# EAGLE design schematic (EAGLE 6.5.0)
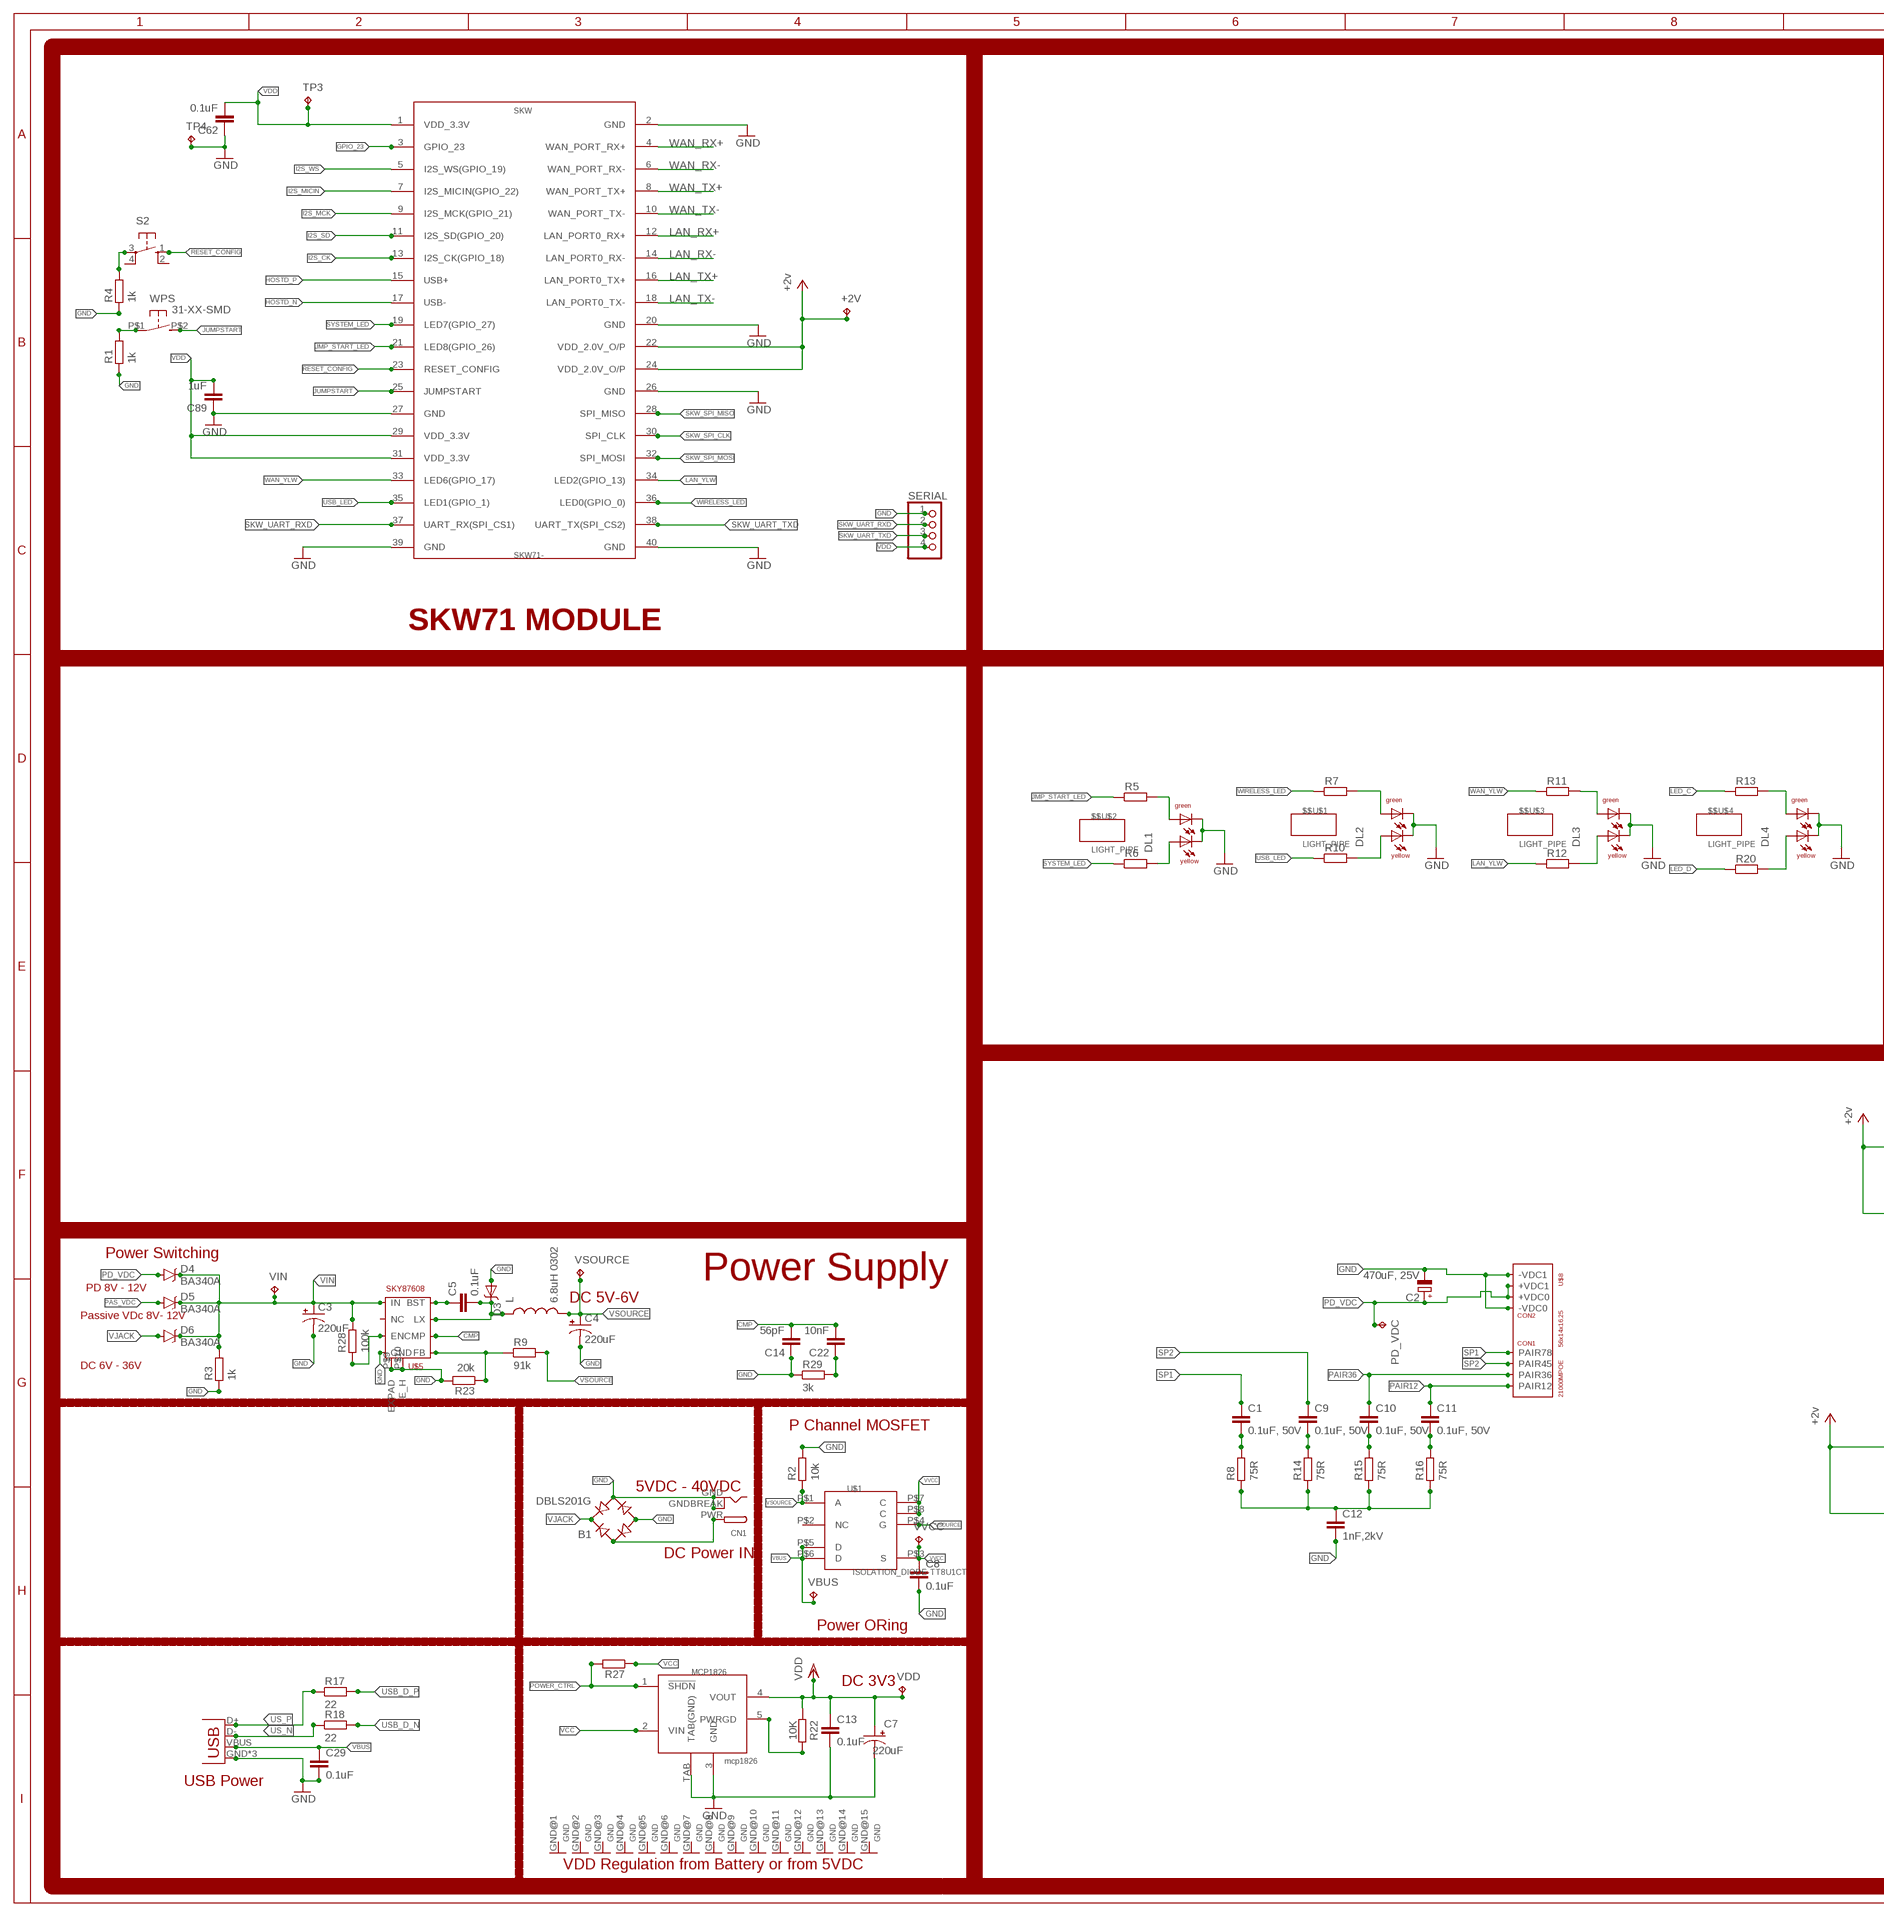
[diagram p0: schematic, sheet 1, part 1 of 2]
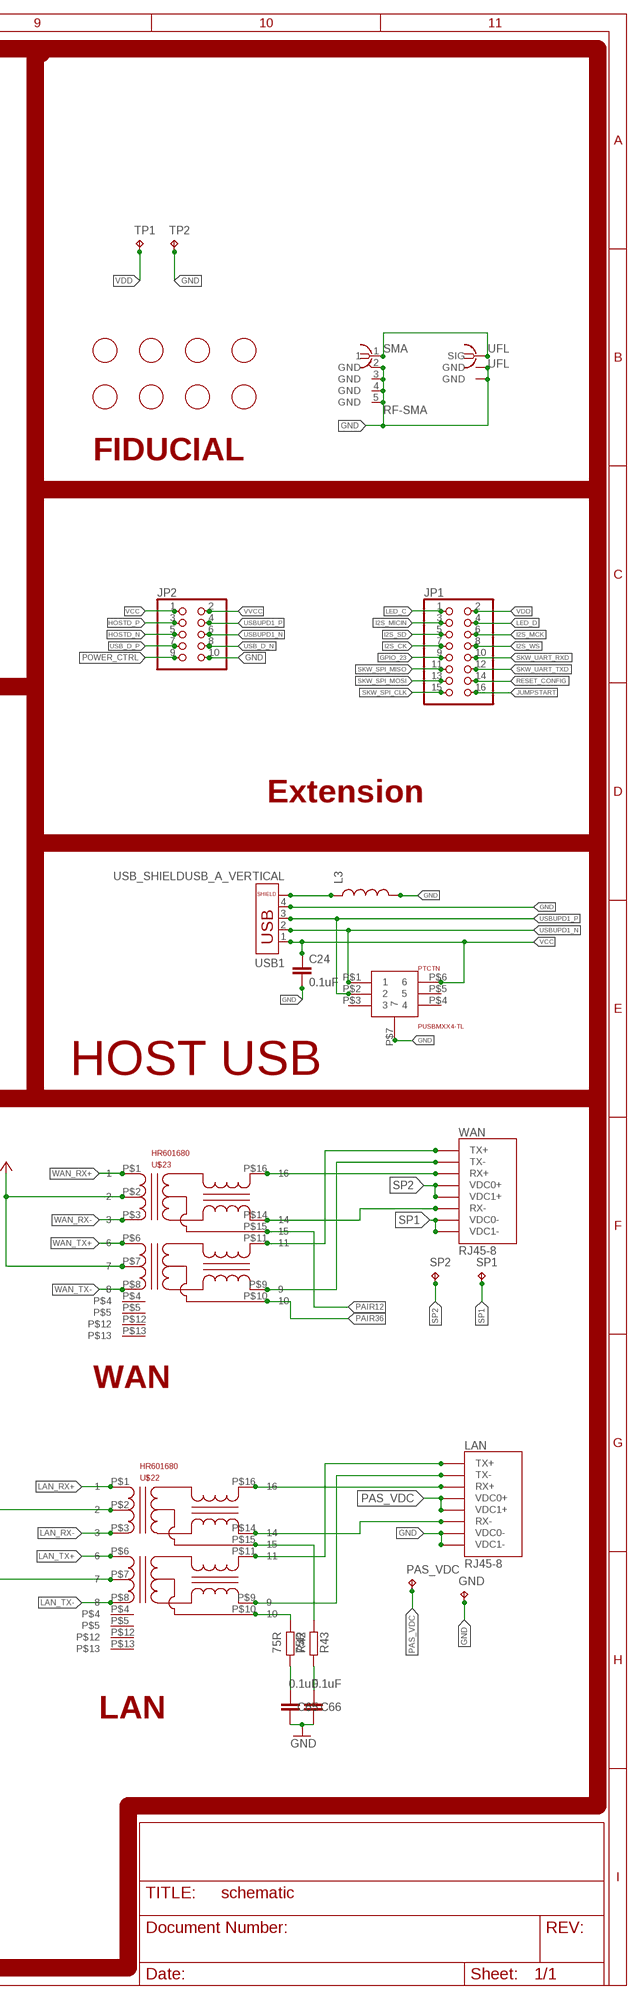
[diagram p1: schematic, sheet 1, part 2 of 2]

## Parts
$$U$1  LIGHT_PIPE  [LIGHT-PIPE]
$$U$2  LIGHT_PIPE  [LIGHT-PIPE]
$$U$3  LIGHT_PIPE  [LIGHT-PIPE]
$$U$4  LIGHT_PIPE  [LIGHT-PIPE]
+2V  TPB2,54  [B2,54]
B1  DBLS201G  [DBS]
C1  0.1uF, 50V  CAPACITOR  [C0603]
C2  470uF, 25V  CPOL-EUE3.5-10  [E3,5-10]
C3  220uF  CPOL-USE3.5-10  [E3,5-10]
C4  220uF  CPOL-USE5-10.5  [E5-10,5]
C5  0.1uF  CAPACITOR  [C0603]
C7  220uF  CPOL-USE5-10.5  [E5-10,5]
C8  0.1uF  CAPACITOR  [C0603]
C9  0.1uF, 50V  CAPACITOR  [C0603]
C10  0.1uF, 50V  CAPACITOR  [C0603]
C11  0.1uF, 50V  CAPACITOR  [C0603]
C12  1nF,2kV  CAPACITOR  [C0603]
C13  0.1uF  CAPACITOR  [C0603]
C14  56pF  CAPACITOR  [C0603]
C22  10nF  CAPACITOR  [C0603]
C24  0.1uF  CAPACITOR  [C0603]
C29  0.1uF  CAPACITOR  [C0603]
C62  0.1uF  CAPACITOR  [C0603]
C65  0.1uF  CAPACITOR  [C0603]
C66  0.1uF  CAPACITOR  [C0603]
C89  1uF  CAPACITOR  [C0603]
CN1  DCBARRELPTH  [DCJACK_2MM_PTH]
D3  DIODE-SCHOTTKY_  [SMA-DIODE]
D4  BA340A  B340A  [SMA-DIODE]
D5  BA340A  B340A  [SMA-DIODE]
D6  BA340A  B340A  [SMA-DIODE]
DL1  DUOLED-1X2  [DUOLED-C-0603]
DL2  DUOLED-1X2  [DUOLED-C-0603]
DL3  DUOLED-1X2  [DUOLED-C-0603]
DL4  DUOLED-1X2  [DUOLED-C-0603]
GND  TPB2,54  [B2,54]
JP1  PINHD-2X8  [2X08]
JP2  PINHD-2X5  [2X05]
JP4  USB-MICROB  [USB-MICROB]
L  6.8uH 0302  INDUCTORBOURNS_SRN6045  [SRN6045]
L3  INDUCTOR0603  [0603]
LAN  RJ45-8  [RJHSE-5080-ND]
MCP1826  mcp1826  MCP1825T  [SOT223-5]
PAS_VDC  TPB2,54  [B2,54]
PD_VDC  TPB2,54  [B2,54]
PTCTN  PUSBMXX4-TL  [PUSBMXX4-TL]
R1  1k  RESISTOR  [R0603]
R2  10k  RESISTOR  [R0603]
R3  1k  RESISTOR  [R0603]
R4  1k  RESISTOR  [R0603]
R5  RESISTOR  [R0603]
R6  RESISTOR  [R0603]
R7  RESISTOR  [R0603]
R8  75R  RESISTOR  [R0603]
R9  91k  RESISTOR  [R0603]
R10  RESISTOR  [R0603]
R11  RESISTOR  [R0603]
R12  RESISTOR  [R0603]
R13  RESISTOR  [R0603]
R14  75R  RESISTOR  [R0603]
R15  75R  RESISTOR  [R0603]
R16  75R  RESISTOR  [R0603]
R17  22  RESISTOR  [R0603]
R18  22  RESISTOR  [R0603]
R20  RESISTOR  [R0603]
R22  10K  RESISTOR  [R0603]
R23  20k  RESISTOR  [R0603]
R27  RESISTOR  [R0603]
R28  100k  RESISTOR  [R0603]
R29  3k  RESISTOR  [R0603]
R42  75R  RESISTOR  [R0603]
R43  75R  RESISTOR  [R0603]
S2  10-XX  [B3F-10XX]
SERIAL  PINHD-1X4  [1X04]
SKW  SKW71-  [SKW71-SMT]
SMA  RF-SMA  [BU-SMA-H]
SP1  TPB2,54  [B2,54]
SP2  TPB2,54  [B2,54]
TP1  TPB2,54  [B2,54]
TP2  TPB2,54  [B2,54]
TP3  TPB2,54  [B2,54]
TP4  TPB2,54  [B2,54]
U$1  ISOLATION_DIODE-TT8U1CT  [8-TSST]
U$5  SKY87608  [8PIN-SOP-8L-EP]
U$8  21000MPOE  [21000MPOE]
U$9  FIDUCIAL  [FIDUCIAL_1MM]
U$11  FIDUCIAL  [FIDUCIAL_1MM]
U$12  FIDUCIAL  [FIDUCIAL_1MM]
U$13  FIDUCIAL  [FIDUCIAL_1MM]
U$14  FIDUCIAL  [FIDUCIAL_1MM]
U$15  FIDUCIAL  [FIDUCIAL_1MM]
U$16  FIDUCIAL  [FIDUCIAL_1MM]
U$17  FIDUCIAL  [FIDUCIAL_1MM]
U$22  HR601680  [SOIC-16]
U$23  HR601680  [SOIC-16]
UFL  UFL  [UFL]
USB1  USB_SHIELDUSB_A_VERTICAL  [USB_A_VERTICAL_PTH]
VBUS  TPB2,54  [B2,54]
VDD  TPB2,54  [B2,54]
VIN  TPB2,54  [B2,54]
VSOURCE  TPB2,54  [B2,54]
VVCC  TPB2,54  [B2,54]
WAN  RJ45-8  [RJHSE-5080-ND]
WPS  31-XX-SMD  [BF3-31XX_SMD_PAD]

## Nets
+2V [power]: +2V.TP SKW.22(VDD_2.0V_O/P) SKW.24(VDD_2.0V_O/P) U$22.P$2 U$22.P$7 U$23.P$2 U$23.P$7 ; supply symbol labelled +2v
CMP: C14.2 C22.2 U$5.P$6(CMP)
GND: B1.- B1.AC2 C2.- C3.- C4.- C7.- C8.2 C12.2 C13.2 C14.1 C24.2 C29.2 C62.1 C65.1 C66.1 C89.1 CN1.GND CN1.GNDBREAK D3.A DL1.C1 DL1.C2 DL2.C1 DL2.C2 DL3.C1 DL3.C2 DL4.C1 DL4.C2 GND.TP JP2.10 JP4.GND JP4.MT1(GND) JP4.MT2(GND) L3.2 LAN.P$7(VDC0-) LAN.P$8(VDC1-) MCP1826.3(GND) MCP1826.TAB(TAB(GND)) PTCTN.P$7 R1.1 R2.2 R3.1 R4.1 R23.2 R29.1 SERIAL.1 SKW.2(GND) SKW.20(GND) SKW.26(GND) SKW.27(GND) SKW.39(GND) SKW.40(GND) SMA.2(GND) SMA.3(GND) SMA.4(GND) SMA.5(GND) TP2.TP TP4.TP U$5.P$4(GND) U$5.P$9(EXPAD) U$5.P$10(E_H) U$8.P$5(-VDC0) U$8.P$8(-VDC1) UFL.GND@1(GND) UFL.GND@2(GND) USB1.4
GPIO_23: JP1.9 SKW.3(GPIO_23)
HOSTD_N: JP2.5 SKW.17(USB-)
HOSTD_P: JP2.3 SKW.15(USB+)
I2S_CK: JP1.7 SKW.13(I2S_CK(GPIO_18))
I2S_MCK: JP1.6 SKW.9(I2S_MCK(GPIO_21))
I2S_MICIN: JP1.3 SKW.7(I2S_MICIN(GPIO_22))
I2S_SD: JP1.5 SKW.11(I2S_SD(GPIO_20))
I2S_WS: JP1.8 SKW.5(I2S_WS(GPIO_19))
JMP_START_LED: R5.1 SKW.21(LED8(GPIO_26))
JUMPSTART: JP1.16 SKW.25(JUMPSTART) WPS.P$2(S)
LAN_RX+: SKW.12(LAN_PORT0_RX+) U$22.P$1
LAN_RX-: SKW.14(LAN_PORT0_RX-) U$22.P$3
LAN_TX+: SKW.16(LAN_PORT0_TX+) U$22.P$6
LAN_TX-: SKW.18(LAN_PORT0_TX-) U$22.P$8
LAN_YLW: R12.1 SKW.34(LED2(GPIO_13))
LED_C: JP1.1 R13.1
LED_D: JP1.4 R20.1
N$1: DL2.A1 R7.2
N$2: C5.2 D3.C L.1 U$5.P$2(LX)
N$3: DL1.A1 R5.2
N$4: DL2.A2 R10.2
N$5: R1.2 WPS.P$1(P)
N$7: C1.2 R8.2
N$10: R4.2 S2.3(P)
N$13: C9.2 R14.2
N$16: SMA.1 UFL.SIG
N$17: DL3.A2 R12.2
N$18: C10.2 R15.2
N$19: DL4.A1 R13.2
N$20: MCP1826.5(PWRGD) R22.2
N$21: C12.1 R8.1 R14.1 R15.1 R16.1
N$22: R28.1 U$5.P$7(EN)
N$24: C11.2 R16.2
N$26: C5.1 U$5.P$8(BST)
N$27: R9.1 R23.1 U$5.P$5(FB)
N$29: DL4.A2 R20.2
N$35: DL3.A1 R11.2
N$37: C22.1 R29.2
N$40: DL1.A2 R6.2
N$41: L3.1 USB1.P$3
N$44: B1.AC1 CN1.PWR
N$48: U$23.P$16 WAN.P$3(RX+)
N$49: U$23.P$14 WAN.P$6(RX-)
N$51: U$23.P$11 WAN.P$1(TX+)
N$52: U$23.P$9 WAN.P$2(TX-)
N$54: R42.1 U$22.P$10
N$55: LAN.P$2(TX-) U$22.P$9
N$56: LAN.P$1(TX+) U$22.P$11
N$57: R43.1 U$22.P$15
N$58: LAN.P$6(RX-) U$22.P$14
N$59: LAN.P$3(RX+) U$22.P$16
N$69: C65.2 R42.2
N$70: C66.2 R43.2
PAIR12: C11.1 U$8.P$1(PAIR12) U$23.P$15
PAIR36: C10.1 U$8.P$2(PAIR36) U$23.P$10
PAS_VDC: D5.A LAN.P$4(VDC0+) LAN.P$5(VDC1+) PAS_VDC.TP
PD_VDC: C2.+ D4.A PD_VDC.TP U$8.P$6(+VDC0) U$8.P$7(+VDC1)
POWER_CTRL: JP2.9 MCP1826.1(!SHDN) R27.2
RESET_CONFIG: JP1.14 S2.1(S) SKW.23(RESET_CONFIG)
SKW_SPI_CLK: JP1.15 SKW.30(SPI_CLK)
SKW_SPI_MISO: JP1.11 SKW.28(SPI_MISO)
SKW_SPI_MOSI: JP1.13 SKW.32(SPI_MOSI)
SKW_UART_RXD: JP1.10 SERIAL.2 SKW.37(UART_RX(SPI_CS1))
SKW_UART_TXD: JP1.12 SERIAL.3 SKW.38(UART_TX(SPI_CS2))
SP1: C1.1 SP1.TP U$8.P$4(PAIR78) WAN.P$7(VDC0-) WAN.P$8(VDC1-)
SP2: C9.1 SP2.TP U$8.P$3(PAIR45) WAN.P$4(VDC0+) WAN.P$5(VDC1+)
SYSTEM_LED: R6.1 SKW.19(LED7(GPIO_27))
US_N: JP4.D- R18.1
US_P: JP4.D+ R17.1
USB_D_N: JP2.8 R18.2
USB_D_P: JP2.7 R17.2
USB_LED: R10.1 SKW.35(LED1(GPIO_1))
USBUPD1_N: JP2.6 PTCTN.P$1 USB1.2
USBUPD1_P: JP2.4 PTCTN.P$2 USB1.3
VBUS: C29.1 JP4.VBUS U$1.P$5(D) U$1.P$6(D) VBUS.TP
VCC: C24.1 JP2.1 MCP1826.2(VIN) PTCTN.P$6 R27.1 USB1.1
VDD: C7.+ C13.1 C62.2 C89.2 JP1.2 MCP1826.4(VOUT) R22.1 SERIAL.4 SKW.1(VDD_3.3V) SKW.29(VDD_3.3V) SKW.31(VDD_3.3V) TP1.TP TP3.TP VDD.TP
VIN: C3.+ D4.C D5.C D6.C R3.2 R28.2 U$5.P$1(IN) VIN.TP
VJACK: B1.+ D6.A
VSOURCE: C4.+ L.2 R2.1 R9.2 U$1.P$1(A) U$1.P$4(G) VSOURCE.TP
VVCC: C8.1 JP2.2 U$1.P$3(S) U$1.P$7(C) U$1.P$8(C) VVCC.TP
WAN_RX+: SKW.4(WAN_PORT_RX+) U$23.P$1
WAN_RX-: SKW.6(WAN_PORT_RX-) U$23.P$3
WAN_TX+: SKW.8(WAN_PORT_TX+) U$23.P$6
WAN_TX-: SKW.10(WAN_PORT_TX-) U$23.P$8
WAN_YLW: R11.1 SKW.33(LED6(GPIO_17))
WIRELESS_LED: R7.1 SKW.36(LED0(GPIO_0))
Unconnected: PTCTN.P$3 PTCTN.P$4 PTCTN.P$5 S2.2(S1) S2.4(P1) U$1.P$2(NC) U$5.P$3(NC) U$22.P$4 U$22.P$5 U$22.P$12 U$22.P$13 U$23.P$4 U$23.P$5 U$23.P$12 U$23.P$13

## Notes on the sheet
- FIDUCIAL
- SKW71 MODULE
- Extension
- HOST USB
- Power Switching
- Power Supply
- PD 8V - 12V
- DC 5V-6V
- Passive VDc 8V- 12V
- WAN
- DC 6V - 36V
- P Channel MOSFET
- 5VDC - 40VDC
- DC Power IN
- Power ORing
- LAN
- DC 3V3
- USB Power
- VDD Regulation from Battery or from 5VDC

## Power pins joined to a net without a drawn wire
GND: MCP1826.GND@1(GND) MCP1826.GND@2(GND) MCP1826.GND@3(GND) MCP1826.GND@4(GND) MCP1826.GND@5(GND) MCP1826.GND@6(GND) MCP1826.GND@7(GND) MCP1826.GND@8(GND) MCP1826.GND@9(GND) MCP1826.GND@10(GND) MCP1826.GND@11(GND) MCP1826.GND@12(GND) MCP1826.GND@13(GND) MCP1826.GND@14(GND) MCP1826.GND@15(GND)

## Library data of the parts
$$U$1-$$U$4 = BaseApp:LIGHT_PIPE: Digikey No :- __492-1313-ND__
+2V GND PAS_VDC PD_VDC SP1 SP2 TP1-TP4 VBUS VDD VIN VSOURCE VVCC = testpad:TP: Test pad
B1 = rectifier:DB?*G: Single Phase 1.0 AMP Glass Passivated Bridge Rectifier Taiwan Semiconductor Co.,Ltd. - TSC Source: http://www.taiwansemi.com/TSCbig5/ezcatfiles/cust/img/img/db101g.pdf http://www.ts.com.tw/db/pictures/modules/PDT/PDT060207001/DBLS201G.pdf
C1 C5 C8-C14 C22 C24 C29 C62 C65 C66 C89 = BaseApp:CAPACITOR: C0402 & C0603 are general chip capacitors Film Capacitor, 400V's Mouser Part No :- __ECQ-E4474KF__
C2 = resistor:CPOL-EU: POLARIZED CAPACITOR, European symbol
C3 C4 = schematic:CPOL-US: POLARIZED CAPACITOR, American symbol
C7 = adafruit:CPOL-US: POLARIZED CAPACITOR, American symbol
CN1 = adafruit:DCBARREL: 2.0mm DC Barrel Jack DCJACK_2MM_PTH - Through Hole Jack (4UConnector: 05537)
D3 = schematic:DIODE-SCHOTTKY
D4-D6 = SparkFun-DiscreteSemi:B340A: Schottky Diode 3A-40V; PROD_ID: DIO-09886
DL1-DL4 = BaseApp:DUOLED-1X2: Digikey No :- __754-1146-1-ND__
JP1 = pinhead:PINHD-2X8: PIN HEADER
JP2 = pinhead:PINHD-2X5: PIN HEADER
JP4 = SparkFun-Connectors:USB: USB Connectors USB-B-PTH is fully proven SKU : PRT-00139/CONN-08278 USB-miniB is fully proven SKU : PRT-00587 USB-A-PCB is untested. USB-A-H is throughly reviewed, but untested. Spark Fun Electronics SKU : PRT-00437 USB-B-SMT is throughly reviewed, but untested. Needs silkscreen touching up. USB-A-S has not been used/tested USB-MB-H has not been used/tested USB-MICROB has been used. CONN-09505; PROD_ID: CONN-09505
L = SparkFun-Passives:INDUCTOR: Inductors Basic Inductor/Choke - 0603 and 1206. Footprints are not proven and vary greatly between part numbers. SRN6045- 33uH, 20% 1.4A SDR0403-560KL - 56uH, 10%, 500mA RMS/740mA peak; PROD_ID: NDUC-11627; VALUE: 33uH
L3 = SparkFun-Passives:INDUCTOR: Inductors Basic Inductor/Choke - 0603 and 1206. Footprints are not proven and vary greatly between part numbers. SRN6045- 33uH, 20% 1.4A SDR0403-560KL - 56uH, 10%, 500mA RMS/740mA peak
LAN WAN = schematic:RJ45-8: RJ45 Jack Simple RJ45, 8-pin connection - connector for common Cat5, Cat5e, and Cat6 Ethernet cables. Footprint not yet proven in production. Connector sku is PRT-00643; Breakout PCB sku is BOB-00716.
MCP1826 = BaseApp:MCP1825T: Digikey No:- __MCP1825T-5002E/DCCT-ND__
PTCTN = schematic:PUSBMXX4-TL
R1-R18 R20 R22 R23 R27-R29 R42 R43 = BaseApp:RESISTOR: Resistance Package :- 0603 Mount :-Surface mount
S2 = switch-omron:10-XX: OMRON SWITCH; MPN: B3F-1000; OC_FARNELL: 176432; OC_NEWARK: 36M3542
SERIAL = pinhead:PINHD-1X4: PIN HEADER
SKW = BaseApp:SKW71
SMA = BaseApp:RF-SMA
U$1 = BaseApp:ISOLATION_DIODE: Digikey No :- __FDFMA2P857CT-ND__ (6-WDFN). Digikey No :- __TT8U1CT-ND__ (8TSST).Note- The NC pin connects to the A pin
U$5 = schematic:SKY87608
U$8 = schematic:21000MPOE
U$9 U$11-U$17 = adafruit:FIDUCIAL: For use by pick and place machines to calibrate the vision/machine, 1mm By microbuilder.eu
U$22 U$23 = schematic:HR601680
UFL = BaseApp:UFL: DIGIKEY NUMBER :- H9161-ND
USB1 = schematic:USB_SHIELD
WPS = schematic:31-XX-SMD

## Net classes
0 default: width 0.203 mm, drill 0.305 mm, clearance 0.152 mm
1 power: width 0.203 mm, drill 0.305 mm, clearance 0.152 mm
2 gnd: width 0.203 mm, drill 0.305 mm, clearance 0.152 mm

## Board
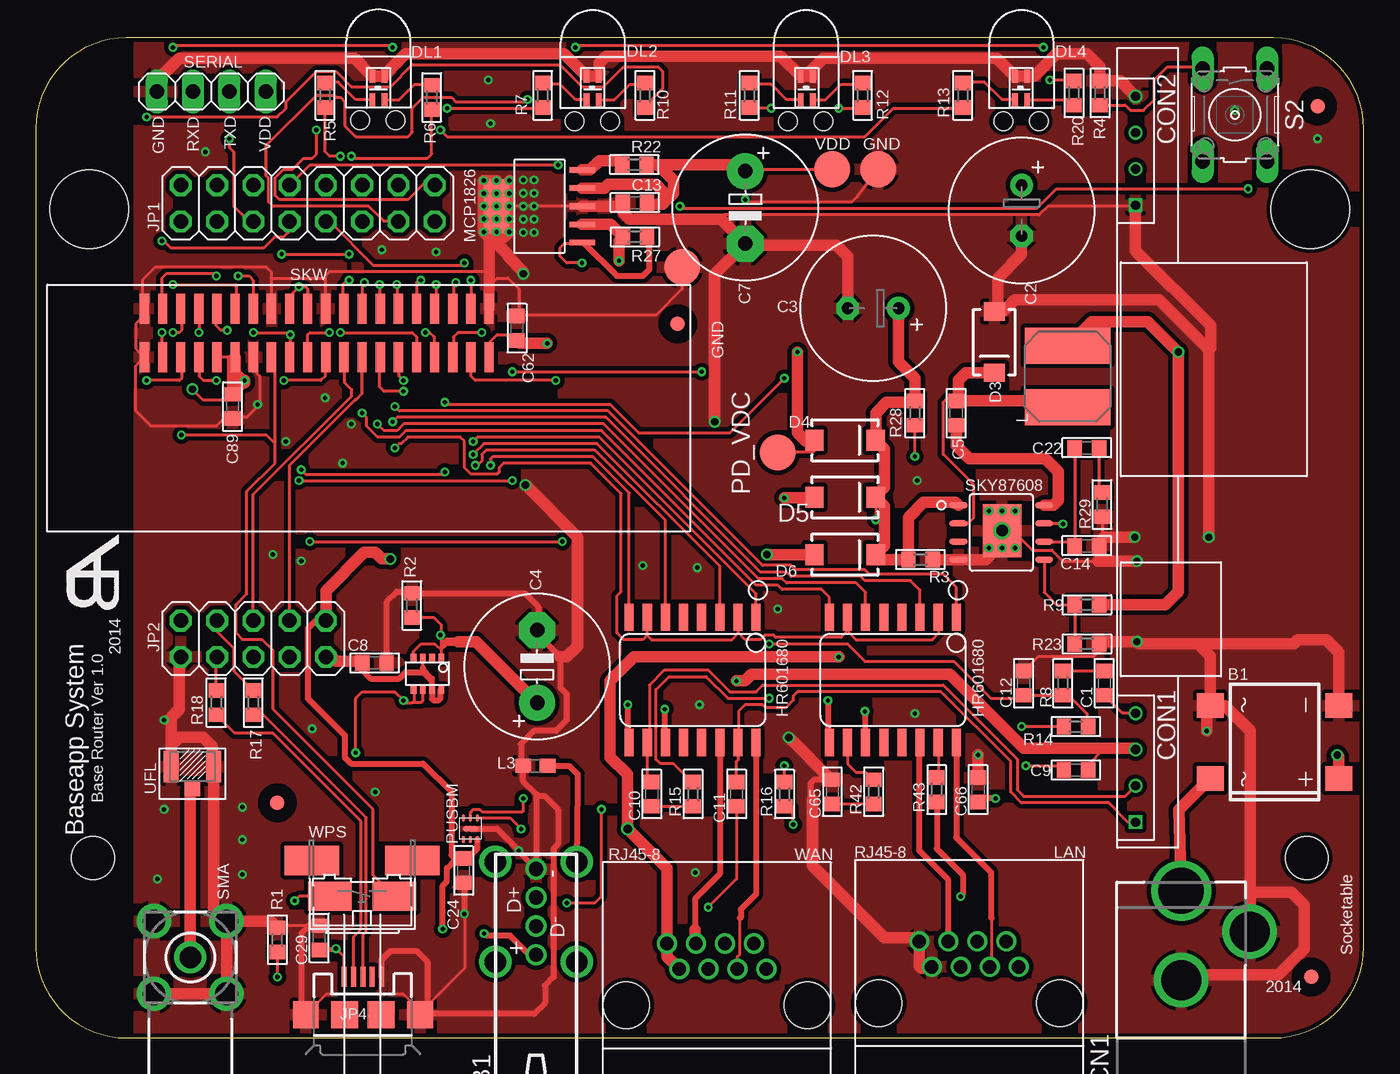
[diagram p2: board, top side]
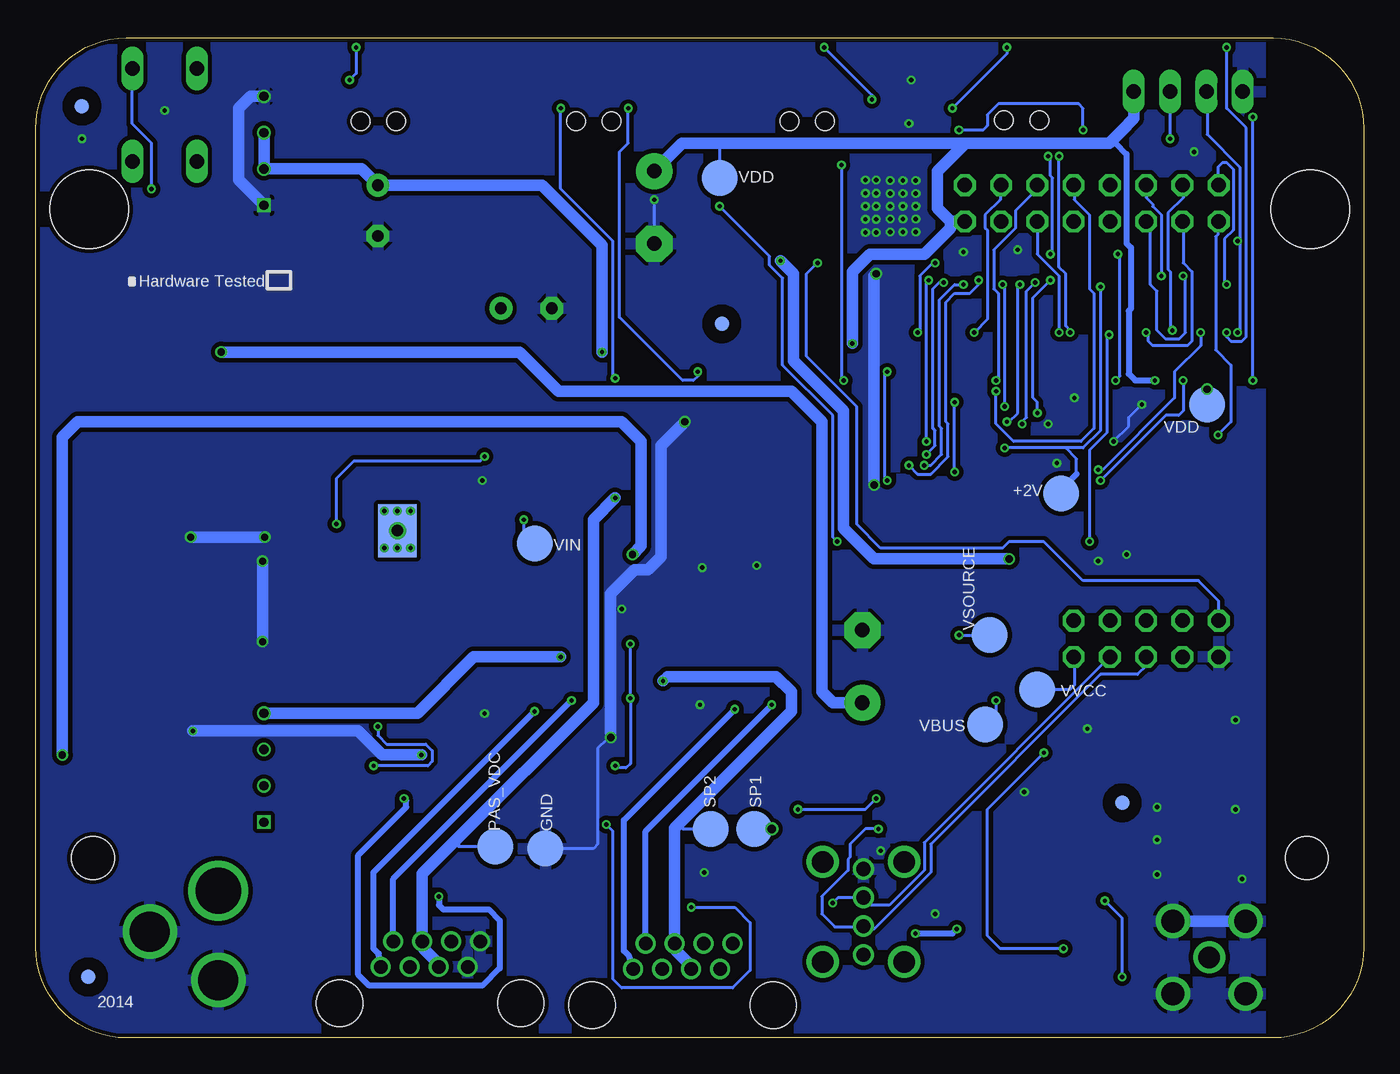
[diagram p3: board, bottom side, seen from below]

Size 93 x 70 mm. Coordinates in mm from the lower left corner, seen from the top.
Outline: 0,63.65 0,6.35 arc90 6.35,0 86.65,0 arc90 93,6.35 93,63.65 arc90 86.65,70 6.35,70 arc90 0,63.65
Copper layers (1*16): Top 0.035mm / dielectric 1.5mm / Bottom 0.035mm
Design rules "smart prototyping": minimum track width 6mil, minimum drill 12mil, track to track 6mil, track to pad 6mil, pad to pad 6mil, via to via 6mil, smd to smd 0mil, copper to edge 10mil, drill to drill 10mil, minimum pad ring 6mil, minimum via ring 6mil, stop-mask expansion 2mil, vias tented up to drill 25mil, thermal gap 10mil
Holes 3 mm at 4,12.6 89,12.6
Holes 5.5 mm at 89.25,58 3.75,58
tRestrict: area -1.1,-2.7 to 6.6,70.7
bRestrict: area -3.7,-4.9 to 6.6,70.7

### Footprints (pad centres in the part's own frame; a part is rotated, then mirrored left to right if it is on the bottom)
LIGHT-PIPE = hole 1.3: 1.214,-0.9; -1.286,-0.9
B2,54 = smd 2.54 x 2.54: TP 0,0
DBS = smd 1.7 x 1.9: + -2.55,-4.5; - 2.55,-4.5; AC1 -2.55,4.5; AC2 2.55,4.5
C0603 = smd 1 x 1.1: 1 -0.85,0; 2 0.85,0
E3,5-10 = drill 0.813 pad 1.6: + -1.778,0 | drill 0.813 pad 1.6 octagon: - 1.778,0
E5-10,5 = drill 1.016 pad 2.54: + -2.54,0 | drill 1.016 pad 2.54 octagon: - 2.54,0
DCJACK_2MM_PTH = drill 2.8: GND 0,7.35; GNDBREAK 4.8,10.75 | drill 3.2: PWR 0,13.6
SMA-DIODE = smd 1.27 x 1.47: A -2.15,0; C 2.15,0
DUOLED-C-0603 = smd 0.9 x 0.4: A1 -0.825,0.43; A2 -0.825,-0.43; C1 0.825,0.43; C2 0.825,-0.43
2X08 = drill 1.016 octagon: 1 -8.89,-1.27; 2 -8.89,1.27; 3 -6.35,-1.27; 4 -6.35,1.27; 5 -3.81,-1.27; 6 -3.81,1.27; 7 -1.27,-1.27; 8 -1.27,1.27; 9 1.27,-1.27; 10 1.27,1.27; 11 3.81,-1.27; 12 3.81,1.27; 13 6.35,-1.27; 14 6.35,1.27; 15 8.89,-1.27; 16 8.89,1.27
2X05 = drill 1.016 octagon: 1 -5.08,-1.27; 2 -5.08,1.27; 3 -2.54,-1.27; 4 -2.54,1.27; 5 0,-1.27; 6 0,1.27; 7 2.54,-1.27; 8 2.54,1.27; 9 5.08,-1.27; 10 5.08,1.27
USB-MICROB = smd 0.35 x 1.4: D+ 0,2.65; D- -0.65,2.65; GND 1.3,2.65; ID 0.65,2.65; VBUS -1.3,2.65 | smd 1.8 x 1.9: MT1 -4,0; MT2 4,0 | smd 1.9 x 1.9: P$1 -1.27,0; P$2 1.27,0
SRN6045 = smd 2.5 x 6: 1 -2.175,-0.175; 2 2.125,-0.175
0603 = smd 1.1 x 1: 1 -0.85,0; 2 0.85,0
RJHSE-5080-ND = drill 0.94: P$1 3.46,2.54; P$2 2.59,4.32; P$3 1.43,2.54; P$4 0.56,4.32; P$5 -0.6,2.54; P$6 -1.47,4.32; P$7 -2.63,2.54; P$8 -3.5,4.32 | hole 3.25: -6.35,0; 6.35,0
SOT223-5 = smd 0.4 x 1.8: 1 -2.54,-3; 2 -1.27,-3; 3 0,-3; 4 1.27,-3; 5 2.54,-3 | drill 0.305: GND@1 -1.8,3.9; GND@2 -0.9,3.9; GND@3 0,3.9; GND@4 0.9,3.9; GND@5 1.8,3.9; GND@6 -1.8,3; GND@7 -0.9,3; GND@8 0,3; GND@9 0.9,3; GND@10 1.8,3; GND@11 -1.8,2.1; GND@12 -0.9,2.1; GND@13 0,2.1; GND@14 0.9,2.1; GND@15 1.8,2.1 | smd 3.81 x 1.8: TAB 0,3
PUSBMXX4-TL = smd 0.5 x 0.2: P$1 -0.75,0.5; P$2 -0.75,0; P$3 -0.75,-0.5; P$4 0.75,-0.5; P$5 0.75,0; P$6 0.75,0.5 | smd 0.4 x 1.1: P$7 0,0
R0603 = smd 1 x 1.1: 1 -0.85,0; 2 0.85,0
B3F-10XX = drill 1.016 long: 1 -3.251,2.261; 2 3.251,2.261; 3 -3.251,-2.261; 4 3.251,-2.261
1X04 = drill 1.016 long: 1 -3.81,0; 2 -1.27,0; 3 1.27,0; 4 3.81,0
SKW71-SMT = smd 0.65 x 2.115: 1 0,0; 2 0,3.385; 3 -1.27,0; 4 -1.27,3.385; 5 -2.54,0; 6 -2.54,3.385; 7 -3.81,0; 8 -3.81,3.385; 9 -5.08,0; 10 -5.08,3.385; 11 -6.35,0; 12 -6.35,3.385; 13 -7.62,0; 14 -7.62,3.385; 15 -8.89,0; 16 -8.89,3.385; 17 -10.16,0; 18 -10.16,3.385; 19 -11.43,0; 20 -11.43,3.385; 21 -12.7,0; 22 -12.7,3.385; 23 -13.97,0; 24 -13.97,3.385; 25 -15.24,0; 26 -15.24,3.385; 27 -16.51,0; 28 -16.51,3.385; 29 -17.78,0; 30 -17.78,3.385; 31 -19.05,0; 32 -19.05,3.385; 33 -20.32,0; 34 -20.32,3.385; 35 -21.59,0; 36 -21.59,3.385; 37 -22.86,0; 38 -22.86,3.385; 39 -24.13,0; 40 -24.13,3.385
BU-SMA-H = drill 1.5: 1 0,0 | drill 1.6: 2 -2.54,2.54; 3 2.54,2.54; 4 2.54,-2.54; 5 -2.54,-2.54
8-TSST = smd 0.4 x 0.6: P$1 -0.975,-1.1; P$2 -0.325,-1.1; P$3 0.325,-1.1; P$4 0.975,-1.1; P$5 0.975,1.1; P$6 0.325,1.1; P$7 -0.325,1.1; P$8 -0.975,1.1
8PIN-SOP-8L-EP = smd 1.27 x 0.42: P$1 -3.048,1.778; P$2 -3.048,0.508; P$3 -3.048,-0.762; P$4 -3.048,-2.032; P$5 2.952,-2.032; P$6 2.952,-0.762; P$7 2.952,0.508; P$8 2.952,1.778 | smd 2.7 x 3.7: P$9 0,0 | drill 0.8: P$10 0,0 | smd 2.7 x 3.7 bottom: P$11 0,0
21000MPOE = drill 0.64 square: P$1 -23.6,1.01; P$5 19.58,1.01 | drill 0.64: P$2 -21.06,1.01; P$3 -18.52,1.01; P$4 -15.98,1.01; P$6 22.12,1.01; P$7 24.66,1.01; P$8 27.2,1.01
FIDUCIAL_1MM = smd 1 x 1: 1 0,0
SOIC-16 = smd 1.905 x 0.635: P$1 -4.445,3.81; P$2 -4.445,2.54; P$3 -4.445,1.27; P$4 -4.445,0; P$5 -4.445,-1.27; P$6 -4.445,-2.54; P$7 -4.445,-3.81; P$8 -4.445,-5.08; P$9 4.318,-5.08; P$10 4.318,-3.81; P$11 4.318,-2.54; P$12 4.318,-1.27; P$13 4.318,0; P$14 4.318,1.27; P$15 4.318,2.54; P$16 4.318,3.81
UFL = smd 1.05 x 2.2: GND@1 -1.475,0; GND@2 1.475,0 | smd 1.1 x 1.1: SIG 0,-1.525
USB_A_VERTICAL_PTH = drill 1: 1 3.45,12.75; 2 3.45,14.75; 3 3.45,16.75; 4 3.45,18.75 | drill 1.5: P$1 0.6,12.25; P$2 6.3,12.25; P$3 6.3,19.25; P$4 0.6,19.25
BF3-31XX_SMD_PAD = smd 3.048 x 2.032: P$1 -2.25,0; P$2 2.25,0 | smd 3.81 x 2.032: P$3 -3.505,2.515; P$4 3.505,2.515

### Placement (x,y rotation side)
$$U$1  39.01,65.07 0 top
$$U$2  24,65.13 0 top
$$U$3  53.95,65.07 0 top
$$U$4  69.04,65.07 0 top
+2V  21.18,38.1 0 bottom
B1  86.75,20.72 90 top
C1  74.83,24.84 90 top
C2  69.04,57.91 270 top
C3  58.64,51.07 180 top
C4  35.11,26 90 top
C5  64.47,43.74 90 top
C7  49.69,58.13 270 top
C8  23.73,26.25 0 top
C9  72.85,18.75 180 top
C10  43.13,17.07 270 top
C11  49.07,17.07 270 top
C12  69.19,24.84 90 top
C13  41.96,58.46 180 top
C14  73.61,34.44 180 top
C22  73.61,41.3 180 top
C24  29.97,11.71 270 top
C29  19.86,7 90 top
C62  33.7,49.68 270 top
C65  55.78,17.22 270 top
C66  65.99,17.37 270 top
C89  13.79,44.2 90 top
CN1  80.21,-3.3 0 top
D3  67.12,48.7 270 top
D4  56.67,41.83 0 top
D5  56.67,37.83 0 top
D6  56.67,33.83 0 top
DL1  24,66.5 90 top
DL2  39,66.5 90 top
DL3  54,66.5 90 top
DL4  69,66.5 90 top
GND  57.3,13.26 0 bottom
JP1  19.05,58.42 180 top
JP2  15.24,27.94 180 top
JP4  22.91,1.63 0 top
L  72.09,46.33 90 top
L3  34.99,19.05 180 top
LAN  65.38,2.44 0 top
MCP1826  35.27,58.22 90 top
PAS_VDC  60.81,13.41 0 bottom
PD_VDC  51.97,41 0 top
PTCTN  30.44,14.65 270 top
R1  16.92,6.86 270 top
R2  26.34,30.28 90 top
R3  61.96,33.48 180 top
R4  74.52,66.14 270 top
R5  20.27,65.99 90 top
R6  27.74,65.84 90 top
R7  35.51,65.99 90 top
R8  71.93,24.84 90 top
R9  73.61,30.33 0 top
R10  42.67,65.99 90 top
R11  49.99,65.99 90 top
R12  57.91,65.99 90 top
R13  64.92,65.99 90 top
R14  72.85,21.79 180 top
R15  46.02,17.07 270 top
R16  52.43,17.07 270 top
R17  15.24,23.47 90 top
R18  12.65,23.47 90 top
R20  72.69,66.14 270 top
R22  41.93,61.12 180 top
R23  73.61,27.58 0 top
R27  41.96,56.08 0 top
R28  61.57,43.74 90 top
R29  74.68,37.34 90 top
R42  58.67,17.22 270 top
R43  63.09,17.37 270 top
S2  83.97,64.62 270 top
SERIAL  12.29,66.24 0 top
SKW  31.75,47.65 0 top
SMA  10.82,5.64 270 top
SP1  42.67,14.63 0 bottom
SP2  45.72,14.63 0 bottom
TP1  55.78,60.81 0 top
TP2  58.98,60.81 0 top
TP3  10.97,44.35 0 bottom
TP4  45.26,53.95 0 top
U$1  27.43,25.5 180 top
U$5  67.67,35.51 0 top
U$8  78.03,38.71 90 top
U$9  44.96,49.99 0 top
U$11  16.92,16.46 0 top
U$12  44.96,49.99 0 bottom
U$13  16.92,16.46 0 bottom
U$14  89.31,4.27 0 bottom
U$15  89.76,65.23 0 bottom
U$16  89.76,65.23 0 top
U$17  89.31,4.27 0 top
U$22  60.66,24.99 270 top
U$23  46.63,24.99 270 top
UFL  10.97,19 0 top
USB1  31.59,-6.93 0 top
VBUS  26.52,21.95 0 bottom
VDD  45.11,60.2 0 bottom
VIN  58.06,34.59 0 bottom
VSOURCE  26.21,28.19 0 bottom
VVCC  22.86,24.38 0 bottom
WAN  47.7,2.29 0 top
WPS  22.86,9.91 0 top

### Tracks (layer width: path | path; a pad name or v marks a point on that pad's centre or on a via)
+2V  (via drill 0.3)
  Top 0.203: 56.84,28.5 57.45,27.89 62.79,27.89 63.25,28.35 63.25,29.39 U$22.P$2 | U$22.P$7 56.84,28.5 | 56.84,28.5 56.39,28.04 51.82,28.04 51.66,28.19 51.05,28.19 50.75,27.89 49.68,27.89 49.23,28.35 | 49.23,28.35 49.23,29.39 U$23.P$2 | 42.82,28.19 43.13,27.89 48.77,27.89 49.23,28.35 | U$23.P$7 42.82,28.19 | 42.82,28.19 42.52,27.89 41.15,27.89 40.69,28.35 40.69,30.94 41,31.24 41,38.1 38.86,40.23 32.77,40.23 32.46,39.93 32.46,39.62 32.31,39.47 30.48,39.47 30.02,39.93 30.02,41.76 29.72,42.06 26.06,42.06 25.6,41.6 25.45,41.6 v25.15,41.3 | SKW.22 19.05,52.43 18.9,52.58 v18.44,52.58 17.77,51.91 SKW.24
  Bottom 0.203: v18.44,52.58 18.44,42.52 19.66,41.3 20.88,41.3 | 20.88,41.3 v25.15,41.3 | 20.12,39.47 20.12,40.54 20.88,41.3
  Bottom 0.406: +2V.TP 21.18,38.41 20.12,39.47
CMP
  Top 0.203: C22.2 C14.2 72.45,34.75 U$5.P$6
GND  (via drill 0.3, 0.51)
  Top 0.203: C29.2 17.06,7.85 R1.1 | JP4.MT2 26.91,1.89 25.76,3.05 20.33,3.05 JP4.MT1 | R29.1 74.68,34.9 74.68,34.66 C14.1 74.83,34.07 74.83,33.83 74.37,33.38 71.93,33.38 71.17,34.14 69.8,34.14 68.43,35.51 U$5.P$10 v67.67,34.29 | R23.2 74.46,27.06 74.07,26.67 70.17,26.67 C12.2 | v30.02,8.69 30.02,4.88 27.43,2.29 | SKW.2 31.75,52.62 32.31,53.19 33.07,53.19 33.83,52.43 33.83,50.66 C62.1 33.77,50.6 43.43,50.6 45.26,52.43 TP4.TP | SKW.26 16.5,53.19 | 16.5,53.19 16.5,53.6 16.15,53.95 8.38,53.95 7.47,53.03 7.47,51.19 SKW.40 7.62,50.59 7.01,49.99 7.01,48.26 SKW.39 7.01,47.05 7.01,43.89 8.08,42.82 12.65,42.82 13.18,43.35 C89.1 13.88,43.43 14.78,43.43 15.7,44.35 15.7,46.33 15.23,46.79 SKW.27 | 20.27,53.19 20.27,51.05 SKW.20 | 16.5,53.19 20.27,53.19 | 16.46,53.19 16.5,53.19 | 31.75,53.65 20.57,53.65 20.27,53.34 20.27,53.19 | MCP1826.GND@13 33.53,58.22 37.95,58.22 MCP1826.3 | 47.98,57.3 48.16,57.61 70.26,57.61 70.87,58.22 76.66,58.22 U$8.P$5 | TP2.TP 57.45,58.83 57.15,58.52 49.84,58.52 v49.68,58.67
  Top 0.406: C29.2 19.13,7.85 18.59,7.32 18.59,1.94 JP4.MT1 | JP4.GND 24.21,5.47 24.84,6.1 26.67,6.1 27.43,5.33 27.43,2.29 27.43,2.15 JP4.MT2 26.96,1.68 34.9,1.68 35.66,2.44 35.66,3.66 36.27,4.27 36.27,13.26 36.58,13.56 36.58,16 35.68,16.9 35.22,16.9 35.04,17.08 | PTCTN.P$7 32.29,14.65 v33.83,13.11 34.36,12.5 USB1.4 35.04,17.08 | v30.02,8.69 30.02,10.81 C24.2 | 35.04,17.08 34.14,17.98 L3.2 33.98,19.2 33.98,20.57 34.9,21.49 36.42,21.49 37.19,22.25 37.19,24.08 36.73,24.54 36.73,26.67 35.11,28.29 C4.- 35.2,28.63 35.2,30.18 34.25,31.13 R2.2 26.23,31.24 25.3,31.24 24.58,30.52 C8.2 | C65.1 54.49,18.07 54.25,17.83 54.25,16.85 54.41,16.7 | v66.75,36.88 v67.67,36.88 v68.58,36.88
  Top 0.813: R3.1 U$5.P$4 66.55,33.48 67.67,34.59 U$5.P$10 | MCP1826.3 40.86,58.22 C13.2 41.11,57.8 41.6,57.3 47.98,57.3 C7.- | SMA.2 12.45,9.09 UFL.GND@2 12.34,19.1 12.34,20.42 11.73,21.03 10.06,21.03 9.5,20.47 UFL.GND@1 9.5,22.45 10.06,23.01 10.06,26.57 JP2.10 | SMA.2 SMA.3 SMA.4 | SMA.2 16.45,8.18 R1.1 | 82.14,48.16 78.64,51.66 68.58,51.66 67.77,50.85 D3.A 67.36,51.09 67.36,53.19 69.04,54.86 C2.- | 82.14,48.16 v82.14,35.05 | v76.96,35.05 74.83,35.05 74.68,34.9 | 74.37,33.38 v77.11,33.38 | R23.2 74.61,27.74 v77.11,27.74 77.27,27.58 81.38,27.58 | B1.AC2 82.25,26.71 81.38,27.58 | B1.- 91.25,27.01 90.37,27.89 88.39,27.89 88.09,27.58 81.38,27.58 | B1.AC2 83.26,23.27 85.04,21.49 85.04,9.91 | 85.04,9.91 85.04,9.15 CN1.GNDBREAK | 85.04,9.91 85.34,10.21 87.94,10.21 88.85,9.3 88.85,6.25 87.02,4.42 80.58,4.42 CN1.GND | U$8.P$5 77.02,55.11 82.3,49.84 82.3,48.31 82.14,48.16 | U$8.P$8 75.94,66.99 R4.1 74.52,67.97 73.61,68.89 71.48,68.89 69.92,67.33 DL4.C2 DL4.C1 67.31,68.58 55.17,68.58 53.91,67.33 DL3.C1 | DL3.C1 DL3.C2 | DL3.C1 52.16,68.73 39.93,68.73 39.43,68.23 DL2.C2 DL2.C1 37.01,68.89 25.91,68.89 24.43,67.41 DL1.C2 DL1.C1 22.32,68.58 10.06,68.58 8.48,67 SERIAL.1 | C3.- 56.87,54.69 56.08,55.47 49.81,55.47 C7.- | 54.41,16.7 54.41,12.04 59.44,7.01 61.63,7.01 LAN.P$8 61.88,5.02 62.03,4.88 62.65,4.88 LAN.P$7 | C66.1 v65.99,19.81 | v81.99,21.49 81.99,23.01 B1.AC2 | C65.1 55.69,18.07 v52.73,21.03 | v47.55,43.13 47.55,53.45 C7.- | SKW.2 31.75,53.65 31.75,56.04 | 31.75,56.04 MCP1826.GND@1 MCP1826.GND@2 MCP1826.GND@3 MCP1826.GND@4 MCP1826.GND@5 MCP1826.GND@10 MCP1826.GND@9 MCP1826.TAB
  Top 0.813: MCP1826.GND@15 MCP1826.GND@14 MCP1826.GND@13 MCP1826.GND@12 MCP1826.GND@11 32.79,56.04 32.65,56.04 | MCP1826.GND@7 32.29,57.32 32.46,57.15 32.46,56.61 MCP1826.GND@6 32.65,56.04 | 31.75,56.04 31.85,56.04 | 31.85,56.04 32.65,56.04 | 36.73,26.67 37.19,26.67 37.95,27.43 37.95,35.05 v34.29,38.71 | v34.14,53.49 34.14,53.65 33.07,54.71 33.07,54.82 31.85,56.04
  Bottom 0.203: GND.TP 53.95,13.26 53.65,13.56 53.65,20.27 53.03,20.88 v52.73,21.03 | v49.68,58.67 49.68,55.63 C7.- | v17.53,41.76 16.46,42.82 16.46,43.43 v15.54,44.35
  Bottom 0.813: SMA.5 SMA.2 | v82.14,35.05 v76.96,35.05 | v77.11,33.38 v77.11,27.74 | U$8.P$8 77.96,65.91 78.79,65.08 78.79,60.06 U$8.P$5 | v65.99,19.81 68.73,19.81 70.41,21.49 v81.99,21.49 | v52.73,21.03 52.73,31.09 51.05,32.77 50.14,32.77 49.23,33.68 49.23,41.45 v47.55,43.13 | v34.29,38.71 34.29,53.34 v34.14,53.49
  other vias: 16.61,33.83 18.59,33.38 42.52,33.07 46.33,32.92 51.97,30.02 61.57,22.71 61.72,39.01 21.49,40.23 22.1,42.98 20.27,44.81 19.35,21.64 23.77,17.22 83.97,64.92 89.76,62.94 31.7,67.06 31.85,64.01 46.48,23.32 46.18,11.58 11.89,62.03 34.9,60.05 34.14,60.05 34.14,59.13 34.14,58.22 34.14,57.3 34.14,56.39 34.9,59.13 34.9,58.22 34.9,57.3 34.9,56.39 28.04,55.02 24.23,55.17 8.99,16 8.99,22.25 14.48,13.87 8.53,11.13 14.48,11.43 14.48,16.15
  pour Top (isolate 0.305): -10.97,73.91 98.76,73.91 99.06,73.61 99.06,-4.88 -10.67,-4.88 -10.97,-4.57
  pour Bottom (isolate 0.305): -8.23,72.39 94.34,72.39 94.64,72.09 94.64,-1.68 -7.92,-1.68 -8.23,-1.37
GND1  (via drill 0.3)
  Top 0.406: v66.75,34.29 v68.58,34.29
GPIO_23  (via drill 0.3)
  Top 0.203: v36.42,46.02 30.79,46.02 30.48,46.33 30.48,47.55 SKW.3 | v36.58,61.11 19.2,61.11 17.98,59.89 17.98,59.74 17.83,59.74 JP1.9
  Bottom 0.203: v36.42,46.02 36.58,46.18 v36.58,61.11
HOSTD_N
  Top 0.203: JP2.5 15.24,38.05 22.12,44.93 22.12,45.39 21.64,45.87 21.64,47.6 SKW.17
HOSTD_P
  Top 0.203: JP2.3 17.78,40.08 22.38,44.68 22.43,44.68 22.86,45.11 SKW.15
I2S_CK  (via drill 0.3)
  Top 0.203: v25.76,45.26 24.38,45.26 24.08,45.57 24.08,47.55 SKW.13
  Bottom 0.203: v25.76,45.26 25.76,42.98 24.54,41.76 19.81,41.76 18.9,42.67 18.9,52.12 19.2,52.43 19.2,57.61 20.27,58.67 20.27,59.59 JP1.7
I2S_MCK  (via drill 0.3)
  Top 0.203: v21.34,49.38 26.36,49.38 26.67,49.07 26.67,47.7 SKW.9
  Bottom 0.203: v21.34,49.38 21.34,53.34 22.86,54.86 JP1.6
I2S_MICIN  (via drill 0.3)
  Top 0.203: v27.28,49.38 27.58,49.38 27.89,49.07 27.89,47.7 SKW.7
  Bottom 0.203: v27.28,49.38 26.36,50.29 26.36,56.54 26.52,56.69 26.52,57.61 25.45,58.67 25.45,59.59 JP1.3
I2S_SD  (via drill 0.3)
  Top 0.203: v25.76,46.02 25.45,46.33 25.45,47.55 SKW.11
  Bottom 0.203: v25.76,46.02 25.6,46.02 25.6,52.12 25.91,52.43 25.91,55.17 24.38,56.69 24.38,57.91 22.86,59.44 JP1.5
I2S_WS  (via drill 0.3)
  Top 0.203: v31.24,49.38 29.57,49.38 29.26,49.07 29.26,47.7 SKW.5 | v30.02,54.25 30.02,54.1 23.62,54.1 20.57,57.15 JP1.8
  Bottom 0.203: v31.24,49.38 31.09,49.38 31.09,53.34 30.18,54.25 v30.02,54.25
JMP_START_LED  (via drill 0.3)
  Top 0.203: v21.34,61.72 20.57,61.72 20.27,62.03 R5.1 | v20.57,49.38 19.2,49.38 19.05,49.23 19.05,47.7 SKW.21
  Bottom 0.203: v21.34,61.72 21.34,53.95 20.88,53.49 20.88,49.84 20.57,49.53 v20.57,49.38
JUMPSTART  (via drill 0.3)
  Top 0.203: 16.76,41.6 16.76,40.23 14.78,38.25 14.78,31.09 14.02,30.33 14.02,28.35 14.48,27.89 15.85,27.89 16.61,27.13 16.61,23.01 23.62,16 23.62,11.39 WPS.P$2 | 16.76,41.6 16.76,47.39 SKW.25 | v10.21,42.22 16.15,42.22 16.76,41.6
  Bottom 0.203: JP1.16 10.21,57.15 10.21,56.24 10.36,56.08 10.36,48.16 9.3,47.09 9.3,43.13 v10.21,42.22
LAN_RX+  (via drill 0.3)
  Top 0.203: U$22.P$1 64.47,31.55 63.55,32.46 58.37,32.46 58.06,32.77 53.19,32.77 52.88,33.07 50.9,33.07 40.08,43.89 25.45,43.89 v25.15,44.2 | v25.3,52.73 25.3,51.13 SKW.12
  Bottom 0.203: v25.15,44.2 25.15,52.58 v25.3,52.73
LAN_RX-  (via drill 0.3)
  Top 0.203: U$22.P$3 61.92,31.34 61.27,32 58.06,32 57.76,32.31 52.88,32.31 52.58,32.61 50.75,32.61 39.93,43.43 25.3,43.43 v24.99,43.13 | v24.08,52.73 24.08,51.08 SKW.14
  Bottom 0.203: v24.99,43.13 24.84,43.13 24.23,43.74 24.23,52.58 v24.08,52.73
LAN_TX+  (via drill 0.3)
  Top 0.203: U$22.P$6 58.12,31.19 57.45,31.85 52.58,31.85 52.27,32.16 50.6,32.16 39.78,42.98 25.76,42.98 25.3,42.52 24.38,42.52 v23.93,42.98 | v23.01,52.88 23.01,52.73 22.86,52.58 SKW.16
  Bottom 0.203: v23.93,42.98 23.93,43.13 23.62,43.43 23.62,52.27 v23.01,52.88
LAN_TX-  (via drill 0.3)
  Top 0.203: U$22.P$8 55.58,30.84 55.02,31.39 52.27,31.39 51.97,31.7 50.44,31.7 39.62,42.52 25.91,42.52 25.45,42.06 23.93,42.06 23.16,42.82 23.16,43.43 v22.86,43.74 | v21.95,53.03 21.79,53.03 21.49,52.73 21.49,51.13 SKW.18
  Bottom 0.203: v22.86,43.74 22.86,44.5 23.16,44.81 23.16,51.82 v21.95,53.03
LAN_YLW  (via drill 0.3)
  Top 0.203: v56.24,65.08 57.91,65.08 R12.1 | v52.43,46.18 48.62,42.37 42.22,42.37 40.23,44.35 28.8,44.35 v28.65,44.5 | v28.65,39.62 28.65,39.47 18.9,39.47 v18.59,39.78 | v11.43,49.38 11.43,50.9 SKW.34
  Bottom 0.203: v56.24,65.08 56.24,59.44 52.58,55.78 52.58,46.33 v52.43,46.18 | v28.65,39.62 v28.65,44.5 | v18.59,39.78 18.29,39.78 13.26,44.81 13.26,46.63 11.43,48.46 v11.43,49.38
LED_C  (via drill 0.3)
  Top 0.203: v28.35,63.55 28.8,63.09 58.06,63.09 60.05,65.08 64.92,65.08 R13.1 | v19.66,63.55 19.66,61.87 19.36,61.57 18.75,61.57 17.98,60.81 17.37,60.81 16.76,60.2 16.76,58.98 17.07,58.67 26.06,58.67 27.13,59.74 27.89,59.74 JP1.1
  Bottom 0.203: v28.35,63.55 26.67,63.55 26.36,63.86 26.36,64.62 25.6,65.38 19.96,65.38 19.66,65.08 v19.66,63.55
LED_D  (via drill 0.3)
  Top 0.203: v71.02,67.06 72.69,67.06 R20.1 | v70.56,69.34 70.56,69.49 37.95,69.49 v37.8,69.34 | v34.44,65.68 34.29,65.53 29.41,65.53 29.11,65.84 27.13,65.84 26.36,65.08 26.36,63.4 26.06,63.09 22.4,63.09 21.64,63.86 21.64,65.53 21.34,65.84 21.03,65.84 20.88,65.99 19.66,65.99 16.15,62.48 16.15,60.35 16.31,60.2 16.31,58.52 16.61,58.22 23.32,58.22 24.38,57.15 JP1.4
  Bottom 0.203: v71.02,67.06 70.56,67.51 v70.56,69.34 | v37.8,69.34 34.44,65.99 v34.44,65.68
N$1
  Top 0.203: DL2.A1 37.8,65.67 36.73,66.75 35.6,66.75 R7.2
N$2
  Top 0.203: U$5.P$2 65.28,36.02 65.68,36.42 65.68,38.71 63.55,40.84 63.55,44.5 63.86,44.81 64.25,44.81 C5.2
  Top 0.813: L.1 71.83,44.59 C5.2 64.62,44.74 64.62,46.02 65.14,46.55 D3.C
N$3
  Top 0.203: DL1.A1 22.41,65.67 21.18,66.9 20.33,66.9 R5.2
N$4
  Top 0.203: DL2.A2 40.53,65.67 41.6,66.75 42.58,66.75 R10.2
N$5  (via drill 0.3)
  Top 0.203: R1.2 v16.92,4.27 | WPS.P$1 18.44,9.91 v18.14,9.6
  Bottom 0.203: v16.92,4.27 16.92,8.38 v18.14,9.6
N$7
  Top 0.203: R8.2 C1.2
N$10
  Top 0.203: R4.2 76.29,65.29 76.66,64.92 77.57,64.92 78.33,65.68 78.33,67.06 79.25,67.97 81.61,67.97 S2.3
N$13  (via drill 0.3)
  Top 0.203: v69.34,19.05 71.93,19.05 71.93,18.75 C9.2 | R14.2 v69.04,21.79
  Bottom 0.203: v69.34,19.05 65.53,19.05 65.23,19.36 65.23,20.12 65.68,20.57 68.43,20.57 69.04,21.18 v69.04,21.79
N$16
  Top 0.813: SMA.1 10.82,17.32 UFL.SIG
N$17
  Top 0.203: DL3.A2 55.31,65.67 56.39,66.75 57.82,66.75 R12.2
N$18
  Top 0.203: C10.2 R15.2
N$19
  Top 0.203: DL4.A1 67.67,65.67 66.45,66.9 64.99,66.9 R13.2
N$20
  Top 0.813: MCP1826.5 38.81,60.76 39.47,61.42 40.78,61.42 R22.2
N$21  (via drill 0.3)
  Top 0.203: R14.1 73.61,21.88 73.61,22.71 72.33,23.99 R8.1 C12.1 68.97,23.77 66.9,23.77 64.31,26.36 58.06,26.36 56.84,27.58 v51.36,27.58 | R15.1 45.94,17.92 44.65,19.2 43.74,19.2 43.43,19.51 43.43,24.38 44.35,25.3 46.94,25.3 48.46,23.77 v51.36,23.77 | R16.1 v52.43,19.05
  Bottom 0.203: v51.36,27.58 v51.36,23.77 51.36,19.2 51.66,18.9 52.27,18.9 v52.43,19.05
N$22  (via drill 0.3)
  Top 0.203: U$5.P$7 71.88,36.02 v71.93,35.97 | v61.57,40.69 R28.1
  Bottom 0.203: v71.93,35.97 71.93,39.17 70.71,40.39 61.87,40.39 v61.57,40.69
N$24  (via drill 0.3)
  Top 0.203: C11.2 49.07,11.12 v47.09,9.14 | v53.03,14.94 53.03,16.15 52.49,16.15 R16.2
  Bottom 0.203: v47.09,9.14 44.04,9.14 42.98,8.08 42.98,4.72 44.2,3.5 51.97,3.5 52.58,4.12 52.58,14.48 v53.03,14.94
N$26
  Top 0.813: U$5.P$8 71.27,37.29 71.63,37.64 71.63,39.62 70.71,40.54 65.38,40.54 64.47,41.45 C5.1
N$27
  Top 0.203: U$5.P$5 70.62,31.19 71.48,30.33 R9.1 R23.1
N$29
  Top 0.203: DL4.A2 72.31,65.67 R20.2
N$35
  Top 0.203: DL3.A1 52.59,65.67 51.51,66.75 50.08,66.75 R11.2
N$37
  Top 0.203: C22.1 74.46,38.41 R29.2
N$40
  Top 0.203: DL1.A2 25.44,65.67 26.52,66.75 27.67,66.75 R6.2
N$41
  Top 0.406: L3.1 37.34,19.05 37.95,18.44 37.95,17.46 USB1.P$3
N$44
  Top 0.813: CN1.PWR 80.06,15.97 B1.AC1
N$48
  Top 0.203: WAN.P$3 49.13,5.7 49.3,5.87 49.3,8.38
  Top 0.406: U$23.P$16 50.44,10.06 49.38,8.99 49.38,8.46 49.3,8.38
N$49
  Top 0.406: U$23.P$14 47.9,11.48 46.18,9.75 46.18,7.57
  Top 0.813: 46.18,7.57 46.18,6.66 WAN.P$6
N$51  (via drill 0.3)
  Top 0.406: v44.04,23.01 44.04,20.73 U$23.P$11
  Bottom 0.406: WAN.P$1 51.46,5.74 51.82,6.1 51.82,15.24 v44.04,23.01
N$52  (via drill 0.3)
  Top 0.406: v41.45,23.32 41.45,20.78 U$23.P$9
  Bottom 0.406: WAN.P$2 50.29,14.48 v41.45,23.32
N$54
  Top 0.203: U$22.P$10 56.84,19.2 57.45,18.59 58.15,18.59 R42.1
N$55  (via drill 0.3)
  Top 0.406: v55.47,23.62 55.47,20.78 U$22.P$9
  Bottom 0.406: LAN.P$2 67.97,11.13 v55.47,23.62
N$56  (via drill 0.3)
  Top 0.406: v58.06,22.86 58.06,20.73 U$22.P$11
  Bottom 0.406: LAN.P$1 68.99,5.89 69.34,6.25 69.34,11.58 v58.06,22.86
N$57
  Top 0.203: U$22.P$15 63.2,18.32 R43.1
N$58
  Top 0.406: LAN.P$6 63.91,11.07 61.87,13.11 61.87,20.62 U$22.P$14
N$59
  Top 0.203: 66.93,8.41 66.93,5.1 LAN.P$3
  Top 0.406: U$22.P$16 64.47,14.02 66.9,11.58 66.9,8.43 66.93,8.41
N$69
  Top 0.203: R42.2 C65.2
N$70  (via drill 0.3)
  Top 0.406: R43.2 63.09,13.26 64.92,11.43 64.92,10.06 v64.77,9.91 | v67.21,16.76 66.23,16.76 C66.2
  Bottom 0.406: v64.77,9.91 64.77,9.3 64.47,8.99 61.27,8.99 60.5,8.23 60.5,4.88 61.72,3.66 69.65,3.66 70.41,4.42 70.41,12.8 67.06,16.15 67.06,16.61 v67.21,16.76
PAIR12
  Top 0.203: U$8.P$1 76.48,15.11 75.13,16.46 69.04,16.46 68.28,17.22 68.28,19.36 63.4,24.23 53.34,24.23 53.03,23.93 53.03,23.62 52.58,23.16 51.05,23.16 50.9,23.32 49.68,23.32 49.23,22.86 49.23,20.73 U$23.P$15 49.23,20.62 49.23,19.51 49.07,19.36 C11.1
PAIR36
  Top 0.203: C10.1 42.82,18.22 U$23.P$10 42.98,20.83 42.98,24.69 44.04,25.76 47.09,25.76 48.62,24.23 50.44,24.23 50.9,24.69 63.55,24.69 68.73,19.51 68.73,17.37 69.19,16.92 76.29,16.92 U$8.P$2
PAS_VDC  (via drill 0.3)
  Top 0.813: v52.43,37.8 54.48,37.8 D5.A
  Bottom 0.203: PAS_VDC.TP 63.4,13.41 63.4,13.56 63.63,13.79
  Bottom 0.813: v52.43,37.8 53.95,36.27 53.95,23.47 63.63,13.79 65.94,11.48 LAN.P$4 65.84,6.66 65.84,6.25 64.78,5.19 LAN.P$5
PD_VDC  (via drill 0.3)
  Top 0.203: PD_VDC.TP 54.41,41 54.56,41.15 54.56,41.45 D4.A
  Top 0.813: v53.34,48.01 53.34,42.37 53.95,41.76 54.45,41.76 D4.A
  Bottom 0.813: U$8.P$7 U$8.P$6 70.18,60.83 C2.+ 57.56,59.69 53.34,55.47 v53.34,48.01
POWER_CTRL  (via drill 0.3)
  Top 0.203: v38.25,54.25 37.19,54.25 36.73,54.71 36.73,55.32 37.03,55.63 38.22,55.63 MCP1826.1
  Top 0.406: MCP1826.1 38.35,55.68 40.69,53.34 42.52,53.34 42.98,53.8 42.98,55.92 R27.2
  Bottom 0.203: JP2.9 10.16,30.58 11.58,32 19.66,32 22.4,34.75 24.84,34.75 25.3,34.29 33.83,34.29 35.51,35.97 35.51,44.2 39.01,47.7 39.01,53.49 v38.25,54.25
RESET_CONFIG  (via drill 0.3)
  Top 0.203: v15.24,49.38 17.83,49.38 v17.83,49.23 17.83,47.7 SKW.23 | v84.89,59.44 71.48,59.44 70.1,58.06 45.26,58.06 v45.11,58.22 | v19.2,34.75 v36.88,34.75
  Bottom 0.203: JP1.14 12.65,57.15 12.65,54.25 12.04,53.65 12.04,48.77 12.34,48.46 14.78,48.46 15.09,48.77 15.09,49.23 v15.24,49.38 | v84.89,59.44 84.89,62.64 86.26,64.01 86.26,67.82 S2.1 | v45.11,58.22 41.6,54.71 41.6,54.1 40.69,53.19 40.69,47.09 37.19,43.59 37.19,35.05 v36.88,34.75 | v19.2,34.75 19.2,41.15 17.98,42.37 17.98,49.07 v17.83,49.23
SKW_SPI_CLK  (via drill 0.3)
  Top 0.203: v9.6,52.73 14.02,52.73 14.02,51.05 SKW.30
  Bottom 0.203: v9.6,52.73 9.75,52.73 9.75,55.93 9.14,56.54 9.14,60.81 9.6,61.27 9.91,61.27 10.21,60.96 10.21,59.74 JP1.15
SKW_SPI_MISO  (via drill 0.3)
  Top 0.203: v14.17,53.34 14.94,53.34 15.24,53.03 15.24,51.05 SKW.28
  Bottom 0.203: v14.17,53.34 14.17,57.61 14.78,58.22 14.78,58.37 15.24,58.83 JP1.11
SKW_SPI_MOSI  (via drill 0.3)
  Top 0.203: v13.41,49.53 12.95,49.53 12.65,49.84 12.65,50.9 SKW.32
  Bottom 0.203: v13.41,49.53 13.56,49.68 13.56,53.65 13.72,53.8 13.72,57.76 12.65,58.83 12.65,59.59 JP1.13
SKW_UART_RXD  (via drill 0.3)
  Top 0.203: v8.84,49.38 8.84,47.7 SKW.37 | v8.84,55.78 8.99,55.78 9.45,55.32 16,55.32 16.76,56.08 17.37,56.08 17.68,56.39 17.68,57.15 JP1.10
  Bottom 0.203: v8.84,49.38 8.69,49.53 8.69,55.78 | 8.69,55.78 8.69,60.96 10.97,63.25 10.97,66.14 SERIAL.2 | 8.69,55.78 v8.84,55.78
SKW_UART_TXD  (via drill 0.3)
  Top 0.203: v12.65,53.34 12.5,53.49 9.14,53.49 8.84,53.19 8.84,51.05 SKW.38 | JP1.12 14.94,57.15 13.87,58.22 13.87,62.03 13.56,62.33 v13.56,62.94
  Bottom 0.203: v12.65,53.34 12.5,53.34 12.5,49.38 12.95,48.92 13.87,48.92 14.48,49.53 14.48,52.27 14.94,52.73 14.94,56.84 JP1.12 | v13.56,62.94 SERIAL.3
SP1  (via drill 0.3, 0.6)
  Top 0.203: U$8.P$4 76.09,22.73 C1.1
  Top 0.813: v56.24,26.67 41.91,26.67 40.23,24.99 40.23,19.66 41.45,18.44 v41.45,14.63 44.2,11.89 44.2,7.53 WAN.P$8 | WAN.P$8 | WAN.P$8 44.2,5.7 WAN.P$7
  Bottom 0.203: v41.45,14.63 SP1.TP
  Bottom 0.813: U$8.P$4 66.27,22.73 62.33,26.67 v56.24,26.67
SP2  (via drill 0.3)
  Top 0.203: C9.1 73.7,19.14 74.83,20.27
  Top 0.813: v49.07,24.99 49.68,24.99 50.14,25.45 64.01,25.45 69.19,20.27 74.83,20.27 76.94,20.27 U$8.P$3
  Bottom 0.203: SP2.TP 47.7,14.63 47.7,14.78 47.93,15.01
  Bottom 0.813: WAN.P$4 48.26,7.42 | WAN.P$4 48.26,14.68 47.93,15.01 40.08,22.86 40.08,24.23 41.15,25.3 48.77,25.3 v49.07,24.99 | WAN.P$5 47.1,5.04 48.16,6.1 48.16,6.5 WAN.P$4
SYSTEM_LED  (via drill 0.3)
  Top 0.203: R6.1 27.74,61.87 27.43,61.57 22.25,61.57 v22.1,61.72 | v17.22,54.86 v21.95,54.86 | v17.37,46.02 19.96,46.02 20.27,46.33 20.27,47.55 SKW.19
  Bottom 0.203: v22.1,61.72 21.95,61.57 21.95,60.35 21.79,60.2 21.79,55.02 v21.95,54.86 | v17.22,54.86 17.07,54.86 17.07,46.33 v17.37,46.02
US_N
  Top 0.203: JP4.D- 22.26,7.07 22.78,7.59 22.78,15.16 16.61,21.34 13.93,21.34 R18.1
US_P
  Top 0.203: JP4.D+ 22.91,7.22 23.14,7.45 23.14,15.42 15.85,22.71 15.33,22.71 R17.1
USB_D_N
  Top 0.203: R18.2 12.65,26.62 JP2.8
USB_D_P
  Top 0.203: JP2.7 12.7,28.45 13.87,27.28 13.87,25.69 R17.2
USB_LED  (via drill 0.3)
  Top 0.203: v7.77,64.47 16.92,64.47 17.53,65.08 17.53,65.53 19.66,67.67 21.03,67.67 22.1,66.6 24.84,66.6 26.36,68.12 36.73,68.12 38.25,66.6 39.78,66.6 41.15,67.97 43.59,67.97 43.89,67.67 43.89,66.45 42.67,65.23 R10.1 | v7.77,46.02 10.06,46.02 10.21,46.18 10.21,47.55 SKW.35
  Bottom 0.203: v7.77,46.02 v7.77,64.47
USBUPD1_N  (via drill 0.3)
  Top 0.203: 32.54,15.4 PTCTN.P$1 33.22,15.4 v33.98,14.63
  Bottom 0.203: v33.98,14.63 34.9,14.63 35.97,13.56 35.97,12.65 36.12,12.5 36.12,11.73 37.95,9.91 37.95,8.69 37.03,7.77 35.09,7.77 USB1.2 34.84,7.62 34.29,7.62 30.33,11.58 30.33,13.56 18.44,25.45 15.85,25.45 15.24,26.06 JP2.6
USBUPD1_P  (via drill 0.3)
  Top 0.203: PTCTN.P$2 30.44,15.81 30.63,16 31.09,16 31.24,15.85 34.09,15.85 34.14,15.9 v34.14,16.76 | v37.19,9.45 39.17,9.45 39.62,9.91 v39.62,16
  Bottom 0.203: JP2.4 30.79,13.66 30.79,11.73 33.22,9.3 34.51,9.3 USB1.3 36.81,9.82 v37.19,9.45 | v39.62,16 34.9,16 v34.14,16.76
VBUS  (via drill 0.3)
  Top 0.203: JP4.VBUS 21.61,5.67 v21.03,6.25 | v21.03,6.25 19.95,6.25 C29.1 20.94,6.15 v21.03,6.25 | v22.4,19.96 22.4,23.77 22.86,24.23 25.15,24.23 v25.76,23.62 25.91,23.47 26.36,23.47 | 26.36,23.47 26.52,23.62 26.52,24.34 U$1.P$5 | U$1.P$6 27.11,23.6 26.98,23.47 26.36,23.47
  Bottom 0.203: v21.03,6.25 25.45,6.25 26.36,7.16 26.36,16 v22.4,19.96 | VBUS.TP 25.76,21.95 v25.76,23.62
VCC  (via drill 0.3, 0.51)
  Top 0.406: JP2.1 19.61,29.21 19.05,28.65 19.05,23.77 21.64,21.18 21.64,19.66 22.1,19.2 27.13,19.2 29.11,17.22 29.11,12.8 29.41,12.5 | 29.41,12.5 29.9,12.5 C24.1 30.24,12.56 30.94,13.26 PTCTN.P$6 30.94,13.87 | USB1.1 34.56,5.82 33.22,7.16 31.55,7.16 v31.39,7.32 | v28.5,7.62 28.5,10.67 28.8,10.97 28.8,11.89 29.41,12.5
  Top 0.813: JP2.1 20.32,31.29 23.01,33.98 23.77,33.98 24.23,33.53 v24.84,33.53 | v40.84,54.41 40.84,55.82 R27.1 40.25,56.95 MCP1826.2
  Bottom 0.406: v31.39,7.32 28.8,7.32 v28.5,7.62
  Bottom 0.813: v24.84,33.53 34.29,33.53 36.42,35.66 36.42,43.89 39.93,47.4 39.93,53.49 v40.84,54.41
VDD  (via drill 0.3, 0.51)
  Top 0.203: SKW.1 31.75,48.66 32.31,49.23 33.3,49.23 C62.2 | SKW.29 SKW.31 | C89.2 13.87,44.65 11.73,44.65 v10.97,45.41 | TP1.TP 50.29,60.81 50.14,60.66 49.99,60.66 C7.+
  Top 0.813: MCP1826.4 39.83,59.49 40.08,59.74 43.43,59.74 44.04,59.13 44.04,58.52 | 44.04,58.52 43.89,58.37 42.91,58.37 C13.1 | C7.+ 49.25,61.12 R22.1 43.58,61.12 44.65,60.05 44.65,59.13 44.04,58.52 | v35.81,48.62 33.91,48.62 C62.2 | v14.63,46.02 13.79,45.19 C89.2 13.79,47.48 SKW.29 13.96,46.54 14.63,45.87
  Bottom 0.203: 16.76,63.25 16.99,63.48 | v10.97,45.41 TP3.TP | 45.11,62.64 VDD.TP
  Bottom 0.406: 17.83,62.64 17.37,62.64 16.61,61.87 16.61,55.63 16.31,55.32 16.31,51.05 16.46,50.9 16.46,46.48 16,46.02 v14.63,46.02
  Bottom 0.813: SERIAL.4 16.1,64.36 16.99,63.48 17.83,62.64 27.89,62.64 | 27.89,62.64 45.11,62.64 47.73,62.64 C7.+ | JP1.2 28.96,57.15 | 28.96,57.15 29.87,58.06 29.87,60.66 27.89,62.64 | 28.96,57.15 28.96,56.69 30.79,54.86 34.59,54.86 35.81,53.65 v35.81,48.62
VIN  (via drill 0.3)
  Top 0.203: v58.83,36.27 58.83,37.19 58.98,37.19 D5.C
  Top 0.813: U$5.P$1 64.41,37.49 62.18,37.49 61.11,36.42 R3.2 59.17,33.48 D6.C 59.44,34.44 59.44,37.22 D5.C 58.82,37.94 59.44,38.56 59.44,41.22 D4.C 58.82,43.73 59.59,44.5 61.48,44.5 R28.2 61.57,46.18 60.42,47.33 C3.+
  Bottom 0.203: VIN.TP 58.83,34.59 v58.83,36.27
VJACK  (via drill 0.51)
  Top 0.813: B1.+ 91.25,19.7 v91.14,19.81 | v51.21,33.83 D6.A
  Bottom 0.813: v91.14,19.81 91.14,42.06 90.07,43.13 51.97,43.13 50.6,41.76 50.6,34.44 v51.21,33.83
VSOURCE  (via drill 0.3, 0.51)
  Top 0.203: 28.41,27.13 28.41,27.34 | 28.41,27.34 28.5,27.43 | U$1.P$1 28.41,27.13 | 28.41,27.34 28.41,28.19 | 28.41,28.19 28.41,28.89 27.89,29.41 26.35,29.41 R2.1 | U$1.P$4 26.46,27.07 26.98,27.58 27.95,27.58 28.41,27.13 | v28.35,28.19 28.41,28.19
  Top 0.406: 28.5,27.43 28.8,27.74
  Top 0.61: 28.8,27.74 29.57,27.74
  Top 0.813: R9.2 79.1,30.33 80.01,31.24 v80.01,48.01 77.88,50.14 73.94,50.14 L.2 | 29.57,27.74 30.84,27.74 C4.+
  Bottom 0.203: v28.35,28.19 VSOURCE.TP
  Bottom 0.813: C4.+ 37.18,23.46 37.95,24.23 37.95,43.13 40.08,45.26 56.39,45.26 59.13,48.01 v80.01,48.01
VVCC
  Top 0.203: U$1.P$3 27.11,25.93 27.13,25.91
  Top 0.406: 27.13,25.91 27.13,25.76 27.74,25.15 27.74,24.99 | 27.74,24.99 27.74,24.42 U$1.P$7 27.76,23.75 27.89,23.62 28.19,23.62 28.35,23.77 28.35,24.34 U$1.P$8 | C8.1 22.88,25.74 23.47,25.15 25.45,25.15 25.91,25.6 27.13,25.6 27.74,24.99
  Top 0.813: JP2.2 20.73,26.67 21.03,26.36 22.77,26.36 C8.1
  Bottom 0.203: VVCC.TP 20.57,24.38 20.27,24.69 20.27,26.67 JP2.2
WAN_RX+  (via drill 0.3)
  Top 0.203: U$23.P$1 50.44,31.09 39.47,42.06 30.94,42.06 v30.63,41.76 | v30.48,53.03 SKW.4
  Bottom 0.203: v30.63,41.76 30.63,52.88 v30.48,53.03
WAN_RX-  (via drill 0.3)
  Top 0.203: U$23.P$3 47.9,33.02 39.32,41.6 31.39,41.6 v30.63,40.84 | v29.41,52.88 29.26,52.73 29.26,51.09 SKW.6
  Bottom 0.203: v30.63,40.84 30.02,41.45 30.02,42.52 30.18,42.67 30.18,52.43 29.72,52.88 v29.41,52.88
WAN_TX+  (via drill 0.3)
  Top 0.203: U$23.P$6 44.09,36.22 39.17,41.15 31.55,41.15 31.24,40.84 31.24,40.39 30.94,40.08 v30.79,40.08 | v28.04,52.73 28.04,51.14 SKW.8
  Bottom 0.203: v30.79,40.08 30.33,40.08 29.57,40.84 29.57,42.67 29.72,42.82 29.72,51.66 28.65,52.73 v28.04,52.73
WAN_TX-  (via drill 0.3)
  Top 0.203: U$23.P$8 41.55,38.15 39.01,40.69 32,40.69 31.85,40.54 v31.85,40.08 | v26.98,53.03 26.82,53.03 26.67,52.88 SKW.10
  Bottom 0.203: v31.85,40.08 31.24,39.47 30.33,39.47 29.11,40.69 29.11,42.98 29.26,43.13 29.26,51.51 28.65,52.12 27.58,52.12 26.98,52.73 v26.98,53.03
WAN_YLW  (via drill 0.3)
  Top 0.203: v51.51,65.08 49.99,65.08 R11.1 | v33.38,46.63 v46.63,46.63 | v18.44,39.01 v33.38,39.01 | v12.65,46.02 11.73,46.02 11.43,46.33 11.43,47.55 SKW.33
  Bottom 0.203: v51.51,65.08 51.51,62.64 52.12,62.03 52.12,50.44 47.7,46.02 46.94,46.02 46.63,46.33 v46.63,46.63 | v33.38,46.63 33.53,46.63 33.53,39.17 v33.38,39.01 | v18.44,39.01 13.87,43.59 12.95,43.59 12.65,43.89 v12.65,46.02
WIRELESS_LED  (via drill 0.3)
  Top 0.203: v28.8,65.08 35.51,65.08 R7.1 | v24.99,69.34 24.99,69.49 9.75,69.49 v9.6,69.34 | v9.6,49.38 10.06,49.38 10.21,49.53 10.21,50.9 SKW.36
  Bottom 0.203: v28.8,65.08 24.99,68.89 v24.99,69.34 | v9.6,69.34 9.6,65.08 8.23,63.7 8.23,49.07 8.53,48.77 9.3,48.77 9.6,49.07 v9.6,49.38

### Text on the board
tPlace: GND | RXD | TXD | VDD | VDD | GND | 2014 | Base Router Ver 1.0 | Baseapp System | PUSBM | Socketable | 2014
bPlace: Hardware Tested | 2014
tNames: GND
bNames: VDD